# EAGLE design camera (EAGLE 9.6.2)
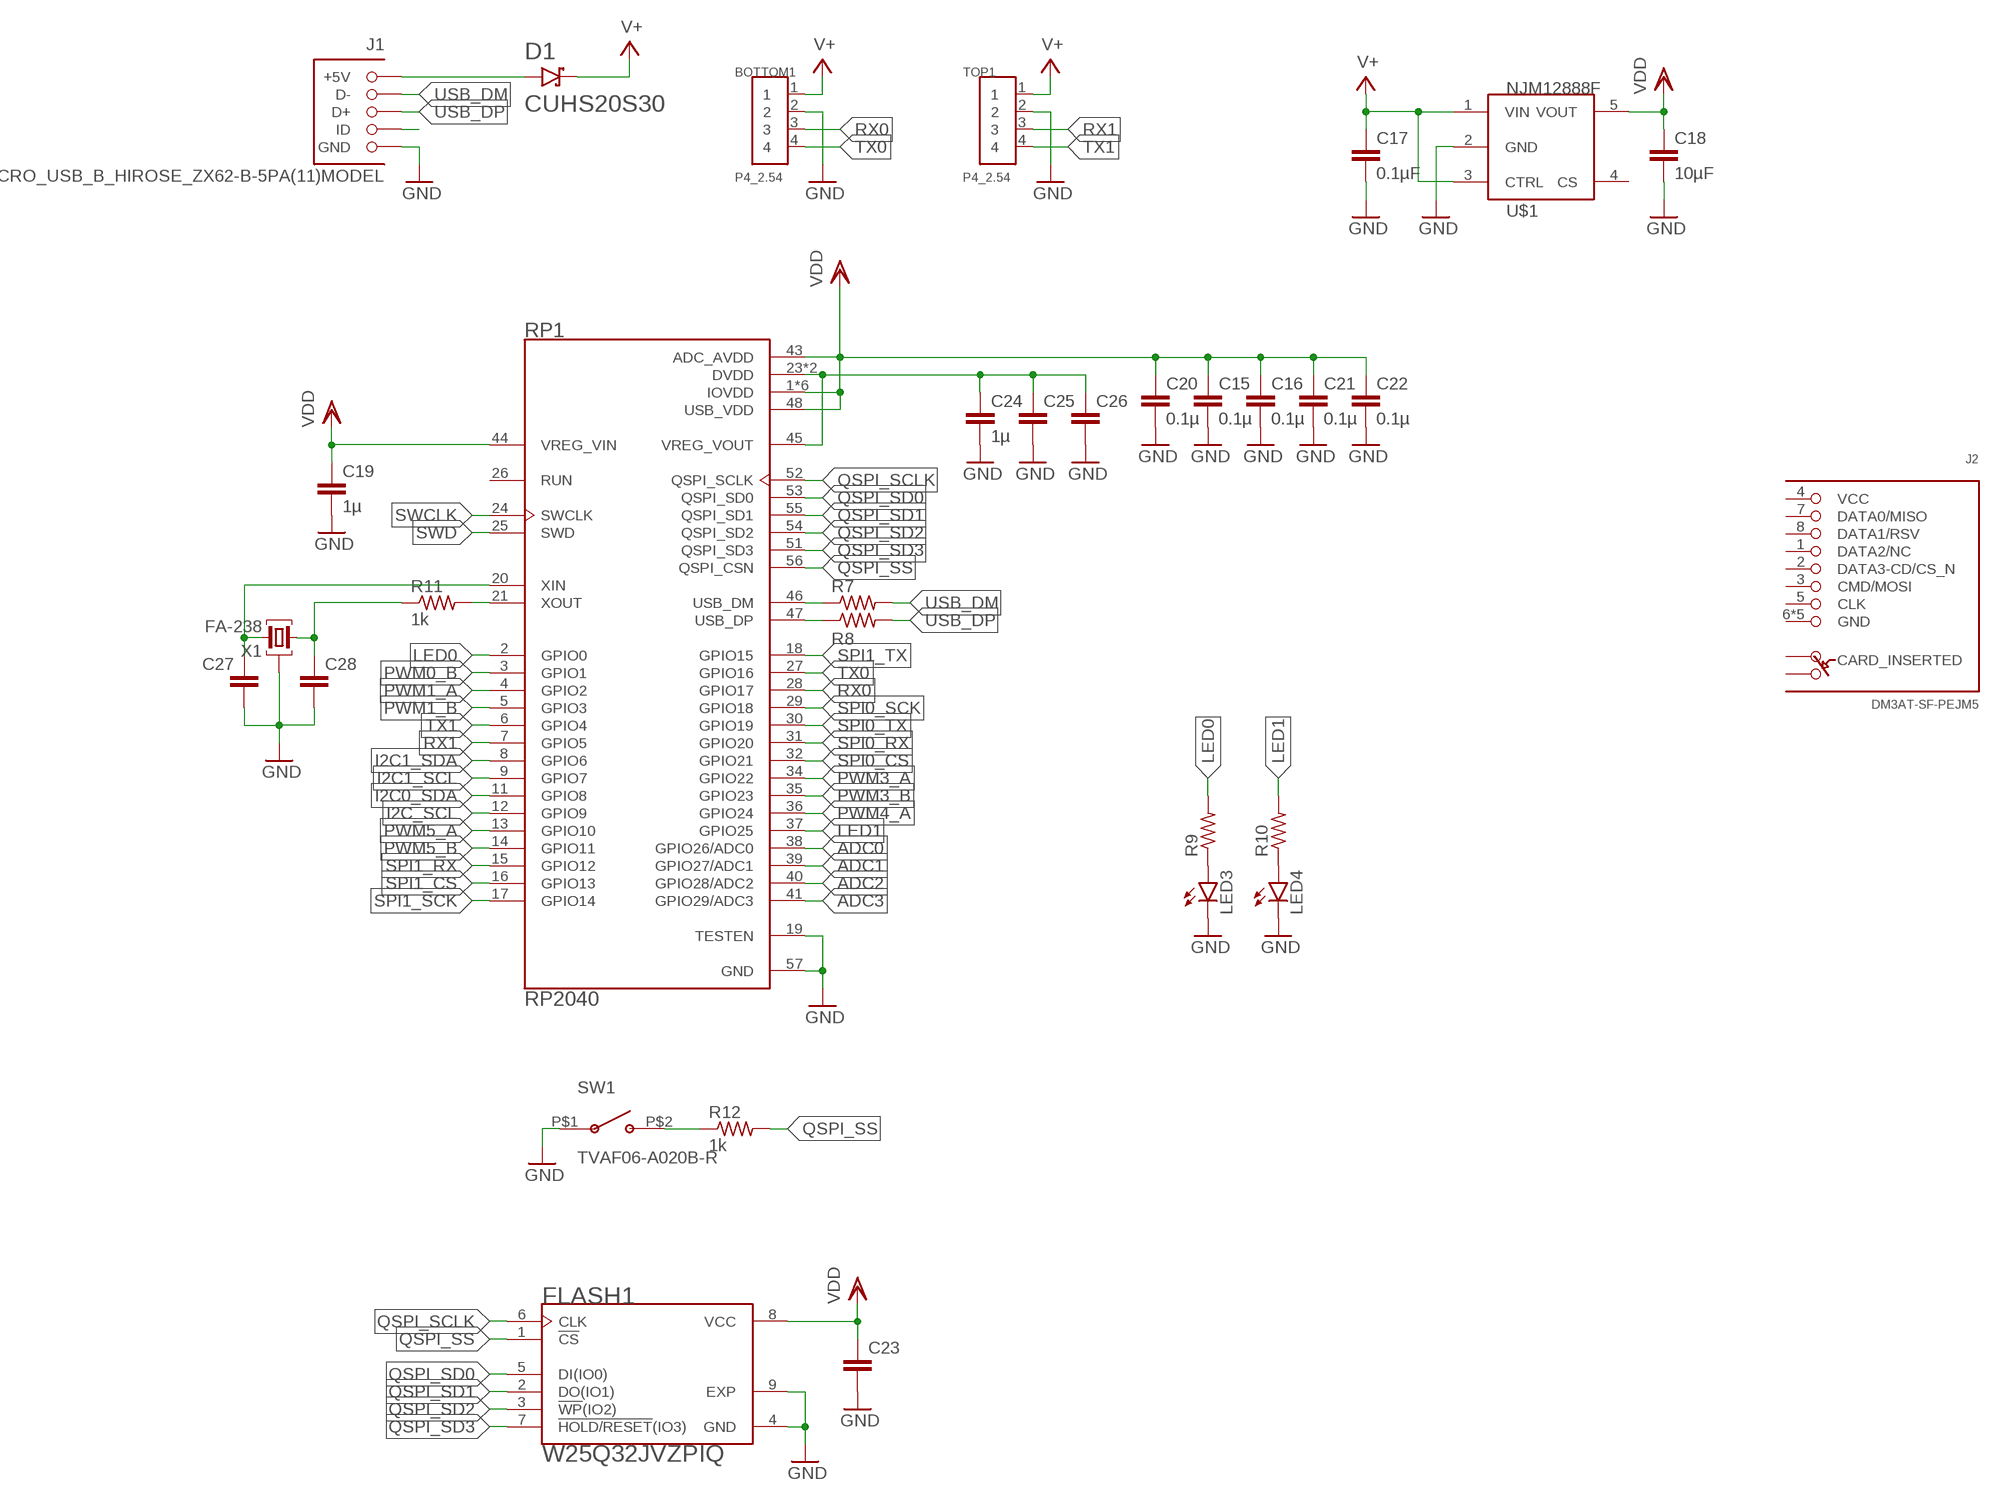
[diagram p0: schematic, sheet 1]

## Parts
BOTTOM1  P4_2.54  [P4_2.54]
C15  0.1µ  C-EUC0402  [C0402]
C16  0.1µ  C-EUC0402  [C0402]
C17  0.1µF  C-EUC0402  [C0402]
C18  10µF  C-EUC0402  [C0402]
C19  1µ  C-EUC0402  [C0402]
C20  0.1µ  C-EUC0402  [C0402]
C21  0.1µ  C-EUC0402  [C0402]
C22  0.1µ  C-EUC0402  [C0402]
C23  C-EUC0402  [C0402]
C24  1µ  C-EUC0402  [C0402]
C25  C-EUC0402  [C0402]
C26  C-EUC0402  [C0402]
C27  C-EUC0402  [C0402]
C28  C-EUC0402  [C0402]
D1  CUHS20S30  [CUHS20S30]
FLASH1  W25Q32JVZPIQ  [SON127P600X500X80-9N]
J1  MICRO_USB_B_HIROSE_ZX62-B-5PA(11)MODEL  [GHI-CONNECTORS_10118192-0001LF(MICRO-USB-B-AMPHENOL-FCI)]
J2  DM3AT-SF-PEJM5  [DM3AT-SF-PEJM5]
LED3  LEDCHIPLED_0603  [CHIPLED_0603]
LED4  LEDCHIPLED_0603  [CHIPLED_0603]
R7  R-US_R0402  [R0402]
R8  R-US_R0402  [R0402]
R9  R-US_R0402  [R0402]
R10  R-US_R0402  [R0402]
R11  1k  R-US_R0402  [R0402]
R12  1k  R-US_R0402  [R0402]
RP1  RP2040  [QFN40P700X700X90-57N]
SW1  TVAF06-A020B-R  [TVAF06-A020B-R]
TOP1  P4_2.54  [P4_2.54]
U$1  NJM12888F  [SOT95P240X110-5N]
X1  FA-238  [FA-238]

## Nets
1V2: C24.1 C25.1 C26.1 RP1.23(DVDD) RP1.45(VREG_VOUT) RP1.50(DVDD)
ADC0: RP1.38(GPIO26/ADC0)
ADC1: RP1.39(GPIO27/ADC1)
ADC2: RP1.40(GPIO28/ADC2)
ADC3: RP1.41(GPIO29/ADC3)
GND: BOTTOM1.2 C15.2 C16.2 C17.2 C18.2 C19.2 C20.2 C21.2 C22.2 C23.2 C24.2 C25.2 C26.2 C27.2 C28.2 FLASH1.4(GND) FLASH1.9(EXP) J1.CGND1(GND) J1.CGND2(GND) J1.CGND3(GND) J1.CGND4(GND) J1.CGND5(GND) J1.CGND6(GND) J1.GND LED3.C LED4.C RP1.19(TESTEN) RP1.57(GND) SW1.P$1(A) TOP1.2 U$1.2(GND) X1.2(G) X1.4(G)
I2C0_SDA: RP1.11(GPIO8)
I2C1_SCL: RP1.9(GPIO7)
I2C1_SDA: RP1.8(GPIO6)
I2C_SCL: RP1.12(GPIO9)
LED0: R9.2 RP1.2(GPIO0)
LED1: R10.2 RP1.37(GPIO25)
N$6: J1.ID
N$8: D1.A J1.VBUS(+5V)
N$9: LED3.A R9.1
N$10: LED4.A R10.1
N$11: C28.1 R11.1 X1.1
N$12: R12.1 SW1.P$2(B)
PWM0_B: RP1.3(GPIO1)
PWM1_A: RP1.4(GPIO2)
PWM1_B: RP1.5(GPIO3)
PWM3_A: RP1.34(GPIO22)
PWM3_B: RP1.35(GPIO23)
PWM4_A: RP1.36(GPIO24)
PWM5_A: RP1.13(GPIO10)
PWM5_B: RP1.14(GPIO11)
QSPI_SCLK: FLASH1.6(CLK) RP1.52(QSPI_SCLK)
QSPI_SD0: FLASH1.5(DI(IO0)) RP1.53(QSPI_SD0)
QSPI_SD1: FLASH1.2(DO(IO1)) RP1.55(QSPI_SD1)
QSPI_SD2: FLASH1.3(!WP!(IO2)) RP1.54(QSPI_SD2)
QSPI_SD3: FLASH1.7(!HOLD/RESET!(IO3)) RP1.51(QSPI_SD3)
QSPI_SS: FLASH1.1(!CS) R12.2 RP1.56(QSPI_CSN)
RX0: BOTTOM1.3 RP1.28(GPIO17)
RX1: RP1.7(GPIO5) TOP1.3
SPI0_CS: RP1.32(GPIO21)
SPI0_RX: RP1.31(GPIO20)
SPI0_SCK: RP1.29(GPIO18)
SPI0_TX: RP1.30(GPIO19)
SPI1_CS: RP1.16(GPIO13)
SPI1_RX: RP1.15(GPIO12)
SPI1_SCK: RP1.17(GPIO14)
SPI1_TX: RP1.18(GPIO15)
SWCLK: RP1.24(SWCLK)
SWD: RP1.25(SWD)
TX0: BOTTOM1.4 RP1.27(GPIO16)
TX1: RP1.6(GPIO4) TOP1.4
USB_DM: J1.D- R7.2
USB_DM_1: R7.1 RP1.46(USB_DM)
USB_DP: J1.D+ R8.2
USB_DP_1: R8.1 RP1.47(USB_DP)
V+: BOTTOM1.1 C17.1 D1.C TOP1.1 U$1.1(VIN) U$1.3(CTRL)
VDD: C15.1 C16.1 C18.1 C19.1 C20.1 C21.1 C22.1 C23.1 FLASH1.8(VCC) RP1.1(IOVDD) RP1.10(IOVDD) RP1.22(IOVDD) RP1.33(IOVDD) RP1.42(IOVDD) RP1.43(ADC_AVDD) RP1.44(VREG_VIN) RP1.48(USB_VDD) RP1.49(IOVDD) U$1.5(VOUT)
XIN1: C27.1 RP1.20(XIN) X1.3
XOUT1: R11.2 RP1.21(XOUT)
Unconnected: J2.1(DATA2/NC) J2.2(DATA3-CD/CS_N) J2.3(CMD/MOSI) J2.4(VCC) J2.5(CLK) J2.6(GND) J2.7(DATA0/MISO) J2.8(DATA1/RSV) J2.A J2.B J2.MOUNT0(GND) J2.MOUNT1(GND) J2.MOUNT2(GND) J2.MOUNT3(GND) RP1.26(RUN) U$1.4(CS)

## Library data of the parts
BOTTOM1 TOP1 = pins:P4_2.54
C15-C28 = rcl:C-EU: CAPACITOR, European symbol; SPICEPREFIX: C
D1 = diodes:CUHS20S30
FLASH1 = W25Q32JVZPIQ:W25Q32JVZPIQ: Serial Flash Memory With Dual, Quad Spi Check availability <https://pricing.snapeda.com/parts/W25Q32JVZPIQ/Winbond/view-part?ref=eda>; AVAILABILITY: In Stock; DESCRIPTION: FLASH - NOR Memory IC 32Mb (4M x 8) SPI - Quad I/O 133 MHz 8-WSON (6x5); MF: Winbond; MP: W25Q32JVZPIQ; PACKAGE: WSON-8 Winbond; PRICE: None; PURCHASE-URL: https://pricing.snapeda.com/search/part/W25Q32JVZPIQ/?ref=eda
J1 = connector:MICRO_USB_B_HIROSE_ZX62-B-5PA(11): Connector Receptacle USB - micro B 2.0 5 Position Surface Mount, Right Angle, Horizontal Bottom Mount
J2 = connector:DM3AT-SF-PEJM5: CONN MICRO SD R/A PUSH-PUSH SMD; DESCRIPTION: CONN MICRO SD CARD PUSH-PUSH R/A; DIGIKEY: HR1964CT-ND; MANUFACTURER: Hirose Electric Co Ltd; MPN: DM3AT-SF-PEJM5
LED3 LED4 = led:LED: LED OSRAM: - CHIPLED LG R971, LG N971, LY N971, LG Q971, LY Q971, LO R971, LY R971 LH N974, LH R974 LS Q976, LO Q976, LY Q976 LO Q996 - Hyper CHIPLED LW Q18S LB Q993, LB Q99A, LB R99A - SideLED LS A670, LO A670, LY A670, LG A670, LP A670 LB A673, LV A673, LT A673, LW A673 LH A674 LY A675 LS A676, LA A676, LO A676, LY A676, LW A676 LS A679, LY A679, LG A679 - Hyper Micro SIDELED® LS Y876, LA Y876, LO Y876, LY Y876 LT Y87S - SmartLED LW L88C, LW L88S LB L89C, LB L89S, LG L890 LS L89K, LO L89K, LY L89K LS L896, LA L896, LO L896, LY L896 - TOPLED LS T670, LO T670, LY T670, LG T670, LP T670 LSG T670, LSP T670, LSY T670, LOP T670, LYG T670 LG T671, LOG T671, LSG T671 LB T673, LV T673, LT T673, LW T673 LH T674 LS T676, LA T676, LO T676, LY T676, LB T676, LH T676, LSB T676, LW T676 LB T67C, LV T67C, LT T67C, LS T67K, LO T67K, LY T67K, LW E67C LS E67B, LA E67B, LO E67B, LY E67B, LB E67C, LV E67C, LT E67C LW T67C LS T679, LY T679, LG T679 LS T770, LO T770, LY T770, LG T770, LP T770 LB T773, LV T773, LT T773, LW T773 LH T774 LS E675, LA E675, LY E675, LS T675 LS T776, LA T776, LO T776, LY T776, LB T776 LHGB T686 LT T68C, LB T68C - Hyper Mini TOPLED® LB M676 - Mini TOPLED Santana® LG M470 LS M47K, LO M47K, LY M47K Source: http://www.osram.convergy.de LUXEON: - LUMILED® LXK2-PW12-R00, LXK2-PW12-S00, LXK2-PW14-U00, LXK2-PW14-V00 LXK2-PM12-R00, LXK2-PM12-S00, LXK2-PM14-U00 LXK2-PE12-Q00, LXK2-PE12-R00, LXK2-PE12-S00, LXK2-PE14-T00, LXK2-PE14-U00 LXK2-PB12-K00, LXK2-PB12-L00, LXK2-PB12-M00, LXK2-PB14-N00, LXK2-PB14-P00, LXK2-PB14-Q00 LXK2-PR12-L00, LXK2-PR12-M00, LXK2-PR14-Q00, LXK2-PR14-R00 LXK2-PD12-Q00, LXK2-PD12-R00, LXK2-PD12-S00 LXK2-PH12-R00, LXK2-PH12-S00 LXK2-PL12-P00, LXK2-PL12-Q00, LXK2-PL12-R00 Source: www.luxeon.com KINGBRIGHT: KA-3528ASYC Source: www.kingbright.com
R7-R12 = rcl:R-US_: RESISTOR, American symbol; SPICEPREFIX: R
RP1 = RP2040:RP2040: Check availability <https://pricing.snapeda.com/parts/RP2040/Raspberry%20Pi/view-part?ref=eda>; AVAILABILITY: In Stock; DESCRIPTION: RP2040 chip for Raspberry Pi Pico - ARM® Cortex®-M0+ MCU 32-Bit; MF: Raspberry Pi; MP: RP2040; PACKAGE: None; PRICE: None; PURCHASE-URL: https://pricing.snapeda.com/search/part/RP2040/?ref=eda
SW1 = switches:TVAF06-A020B-R
U$1 = regulators:NJM12888F
X1 = crystal':FA-238: CRYSTAL

## Board
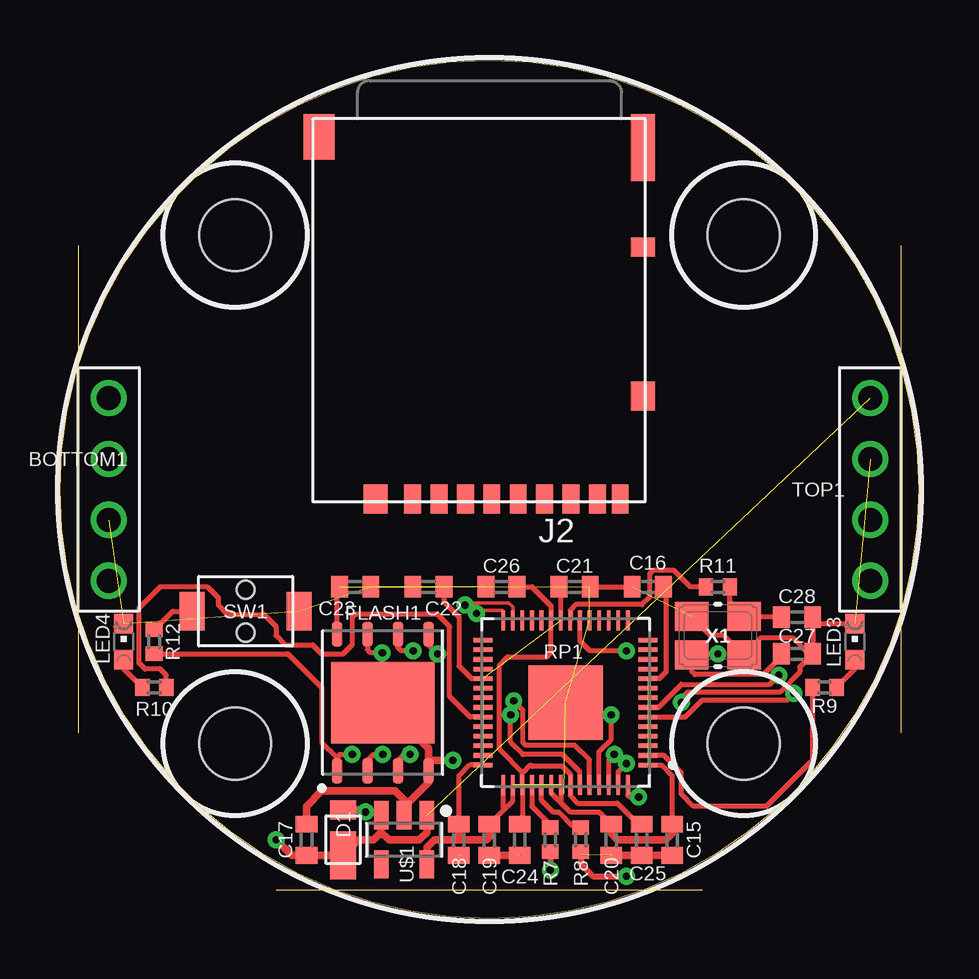
[diagram p1: board, top side]
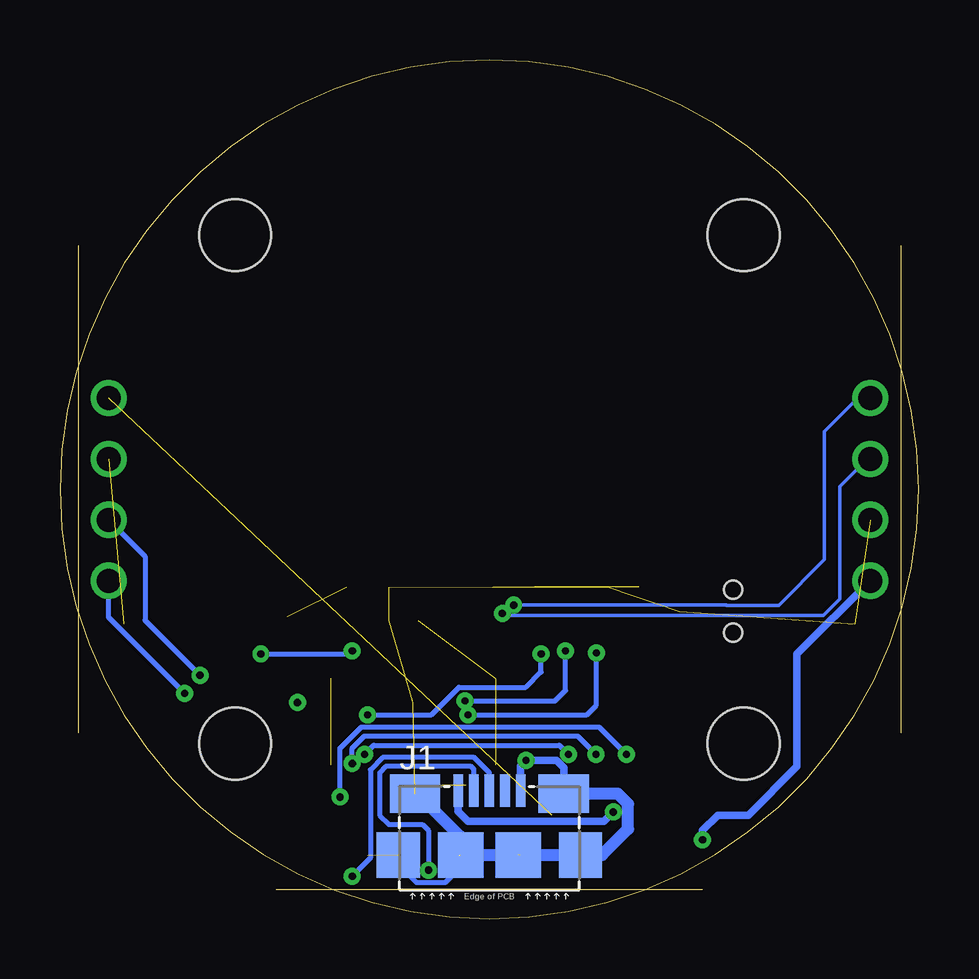
[diagram p2: board, bottom side, seen from below]

Size 35.8 x 35.8 mm. Coordinates in mm from the lower left corner, seen from the top.
Outline: 9.01,1.2 26.79,1.2
Outline: 35.05,28.06 35.05,7.74
Outline: 0.75,28.06 0.75,7.74
Outline: 17.9,0 arc-90 0,17.9 arc-90 17.9,35.8 arc-90 35.8,17.9 arc-90 17.9,0
Copper layers (1*16): Top 0.035mm / dielectric 1.5mm / Bottom 0.035mm
Design rules "default": minimum track width 6mil, minimum drill 0.35mm, track to track 6mil, track to pad 6mil, pad to pad 6mil, via to via 6mil, smd to smd 6mil, copper to edge 40mil, drill to drill 6mil, minimum pad ring 10mil, minimum via ring 8mil, stop-mask expansion 4mil, vias tented up to drill 0mil, thermal gap 10mil
Holes 3 mm at 28.5,28.5 28.5,7.3 7.3,28.5 7.3,7.3

### Footprints (pad centres in the part's own frame; a part is rotated, then mirrored left to right if it is on the bottom)
P4_2.54 = drill 1: 1 0,3.81; 2 0,1.27; 3 0,-1.27; 4 0,-3.81
C0402 = smd 0.7 x 0.9: 1 -0.65,0; 2 0.65,0
CUHS20S30 = smd 0.8 x 1.1: A 1.25,0 | smd 2 x 1.1: C -0.65,0
SON127P600X500X80-9N = smd 1.04 x 0.44: 1 -2.845,1.905; 2 -2.845,0.635; 3 -2.845,-0.635; 4 -2.845,-1.905; 5 2.845,-1.905; 6 2.845,-0.635; 7 2.845,0.635; 8 2.845,1.905 | smd 3.4 x 4.3: 9 0,0
GHI-CONNECTORS_10118192-0001LF(MICRO-USB-B-AMPHENOL-FCI) = smd 1.8 x 1.9: CGND1 -3.8,0; CGND4 3.8,0 | smd 1.9 x 1.9: CGND2 -1.2,0; CGND3 1.2,0 | smd 2.1 x 1.6: CGND5 3.1,2.55; CGND6 -3.1,2.55 | smd 0.4 x 1.35: D+ 0,2.675; D- -0.65,2.675; GND 1.3,2.675; ID 0.65,2.675; VBUS -1.3,2.675
DM3AT-SF-PEJM5 = smd 0.7 x 1.2: 1 3.2,-0.1; 2 2.1,-0.1; 3 1,-0.1; 4 -0.1,-0.1; 5 -1.2,-0.1; 6 -2.3,-0.1; 7 -3.4,-0.1; 8 -4.5,-0.1; B -5.45,-0.1 | smd 1 x 0.8: A -6.4,-10.6 | smd 1 x 1.2: MOUNT0 4.75,-0.1; MOUNT1 -6.4,-4.4 | smd 1 x 2.8: MOUNT2 -6.4,-14.75 | smd 1.3 x 1.9: MOUNT3 7.1,-15.2
CHIPLED_0603 = smd 0.8 x 0.8: A 0,-0.75; C 0,0.75
R0402 = smd 0.6 x 0.7: 1 -0.5,0; 2 0.5,0
QFN40P700X700X90-57N = smd 0.84 x 0.2: 1 -3.435,2.6; 2 -3.435,2.2; 3 -3.435,1.8; 4 -3.435,1.4; 5 -3.435,1; 6 -3.435,0.6; 7 -3.435,0.2; 8 -3.435,-0.2; 9 -3.435,-0.6; 10 -3.435,-1; 11 -3.435,-1.4; 12 -3.435,-1.8; 13 -3.435,-2.2; 14 -3.435,-2.6; 29 3.435,-2.6; 30 3.435,-2.2; 31 3.435,-1.8; 32 3.435,-1.4; 33 3.435,-1; 34 3.435,-0.6; 35 3.435,-0.2; 36 3.435,0.2; 37 3.435,0.6; 38 3.435,1; 39 3.435,1.4; 40 3.435,1.8; 41 3.435,2.2; 42 3.435,2.6 | smd 0.2 x 0.84: 15 -2.6,-3.435; 16 -2.2,-3.435; 17 -1.8,-3.435; 18 -1.4,-3.435; 19 -1,-3.435; 20 -0.6,-3.435; 21 -0.2,-3.435; 22 0.2,-3.435; 23 0.6,-3.435; 24 1,-3.435; 25 1.4,-3.435; 26 1.8,-3.435; 27 2.2,-3.435; 28 2.6,-3.435; 43 2.6,3.435; 44 2.2,3.435; 45 1.8,3.435; 46 1.4,3.435; 47 1,3.435; 48 0.6,3.435; 49 0.2,3.435; 50 -0.2,3.435; 51 -0.6,3.435; 52 -1,3.435; 53 -1.4,3.435; 54 -1.8,3.435; 55 -2.2,3.435; 56 -2.6,3.435 | smd 3.1 x 3.1: 57 0,0
TVAF06-A020B-R = smd 1.6 x 1.05: P$1 0,2.225; P$2 0,-2.225 | hole 0.75: -0.9,0; 0.9,0
SOT95P240X110-5N = smd 1.18 x 0.609: 1 -1.024,0.95; 2 -1.024,0; 3 -1.024,-0.95; 4 1.024,-0.95; 5 1.024,0.95
FA-238 = smd 1.4 x 1.2: 1 -1.1,-0.8; 2 1.1,-0.8; 3 1.1,0.8; 4 -1.1,0.8

### Placement (x,y rotation side)
BOTTOM1  2.02,17.9 180 top
C15  25.52,3.29 270 top
C16  24.5,13.84 180 top
C17  10.28,3.29 90 top
C18  16.63,3.29 270 top
C19  17.9,3.29 270 top
C20  22.98,3.29 270 top
C21  21.46,13.84 0 top
C22  15.36,13.84 180 top
C23  12.31,13.84 0 top
C24  19.17,3.29 270 top
C25  24.25,3.29 270 top
C26  18.41,13.84 180 top
C27  30.73,11.04 0 top
C28  30.73,12.57 0 top
D1  11.8,3.29 90 top
FLASH1  13.45,9.01 90 top
J1  17.9,2.66 0 bottom
J2  17.9,17.39 180 top
LED3  33.14,11.55 0 top
LED4  2.66,11.55 0 top
R7  20.44,3.29 270 top
R8  21.71,3.29 270 top
R9  31.87,9.64 180 top
R10  3.93,9.64 0 top
R11  27.42,13.84 180 top
R12  3.93,11.55 270 top
RP1  21.07,9.01 180 top
SW1  7.74,12.82 270 top
TOP1  33.77,17.9 0 top
U$1  14.34,3.29 270 top
X1  27.42,11.8 180 top

### Tracks (layer width: path | path; a pad name or v marks a point on that pad's centre or on a via)
1V2
  Top 0.2: C24.1 19.27,4.05 RP1.45 19.27,6.07 19.3,6.09 | C25.1 24.11,3.94 23.23,4.82 21.58,4.82 21.27,5.13 RP1.50 21.27,6.02 20.95,6.34 19.68,6.34 19.61,6.41 19.3,6.09 | 19.3,6.09 18.31,7.07 18.31,10.56 18.67,10.92 20.32,10.92 20.47,11.08 RP1.23 20.47,13.04 19.68,13.84 C26.1
GND  (via drill 0.3)  (14 unrouted)
  Top 0.2: 22.07,13.8 C21.2 C16.2 | C27.2 C28.2 31.64,12.3 LED3.C | X1.2 27.1,11.83 27.63,11.83 28.45,11 X1.4 29.24,11.72 30.52,11.72 31.2,11.04 C27.2 | C27.2 30.84,10.51 30.84,10.28 30.01,9.44 26.16,9.44 25.9,9.18 v25.9,9.01
  Top 0.305: C19.2 C24.2 | C20.2 C25.2 C15.2 | 15.36,6.55 15.41,6.6 v16.38,6.6 | 15.36,6.55 FLASH1.4 15.36,5.67 14.36,4.68 14.34,4.7 U$1.2 14.34,4.95 13.96,5.33 10.91,5.33 10.28,4.69 C17.2 | FLASH1.9 15.36,7.1 15.36,6.55
  Bottom 0.2: J1.CGND1 21.7,2.28 20.94,1.52 19.73,1.52 19.1,2.15 J1.CGND2
  Bottom 0.305: J1.GND 16.6,6.37 v16.38,6.6 15.11,6.6 14.8,6.29 J1.CGND5
  Bottom 0.508: J1.CGND6 20.89,5.21 19.1,3.42 J1.CGND2 J1.CGND3 J1.CGND4 13.2,2.66 12.12,3.74 12.12,4.78 12.55,5.21 J1.CGND5
LED0
  Top 0.2: R9.2 31.37,6.6 29.46,4.69 26.41,4.69 25.9,5.2 25.9,6.09 25.18,6.81 RP1.2
LED1
  Top 0.2: RP1.37 17.1,8.41 16.25,9.26 16.25,12.18 15.74,12.69 12.31,12.69 12.18,12.57 12.18,11.42 11.8,11.04 10.91,11.04 10.53,11.42 9.39,11.42 9.01,11.8 9.01,12.18 8.5,12.69 6.98,12.69 6.6,13.07 6.6,13.38 6.13,13.85 4.19,13.85 3.29,12.95 3.29,10.66 3.55,10.41 4.18,10.41 4.43,10.16 R10.2
N$8  (via drill 0.3)
  Top 0.305: D1.A 12.64,4.54 v12.73,4.45
  Bottom 0.305: J1.VBUS 19.2,4.47 18.79,4.06 13.13,4.06 v12.73,4.45
N$9
  Top 0.2: R9.1 33.14,10.41 LED3.A
N$10
  Top 0.2: R10.1 2.66,10.41 LED4.A
N$11
  Top 0.2: C28.1 30.04,12.6 X1.1 27.92,13.2 R11.1
N$12
  Top 0.2: R12.1 4.7,12.82 SW1.P$2
QSPI_SCLK  (via drill 0.3)
  Top 0.2: RP1.52 22.07,6.61 21.46,7.23 19.42,7.23 19.3,7.36 19.3,8.69 v18.92,9.08 | v14.72,11.17 14.24,11.17 14.09,11.32 FLASH1.6
  Bottom 0.2: v18.92,9.08 15.17,9.08 14.72,9.52 v14.72,11.17
QSPI_SD0  (via drill 0.3)
  Top 0.2: RP1.53 22.47,6.98 22.98,7.49 v22.98,8.5 | v15.74,11.04 15.36,11.42 FLASH1.5
  Bottom 0.2: v22.98,8.5 20.31,8.5 19.17,9.64 16.38,9.64 15.74,10.28 v15.74,11.04
QSPI_SD1  (via drill 0.3)
  Top 0.2: RP1.55 23.27,6.13 v23.61,6.47 | FLASH1.2 12.82,6.6 13.07,6.85 v13.45,6.85
  Bottom 0.2: v23.61,6.47 23.61,7.1 23.11,7.61 14.22,7.61 v13.45,6.85
QSPI_SD2  (via drill 0.3)
  Top 0.2: RP1.54 22.88,6.62 v23.11,6.85 | FLASH1.3 14.09,6.6 14.34,6.85 v14.6,6.85
  Bottom 0.2: v23.11,6.85 22.73,7.23 14.98,7.23 v14.6,6.85
QSPI_SD3  (via drill 0.3)
  Top 0.2: RP1.51 21.67,6.12 20.95,6.85 19.3,6.85 18.79,7.36 v18.79,8.5 | v13.43,11.09 12.96,11.09 12.82,11.22 FLASH1.7
  Bottom 0.2: v18.79,8.5 13.84,8.5 13.43,8.9 v13.43,11.09
QSPI_SS  (via drill 0.3)
  Top 0.2: RP1.56 23.67,5.14 23.74,5.07 v24.12,5.07 | FLASH1.1 11.55,6.72 | v12.18,6.85 11.68,6.85 11.55,6.72 | R12.2 9.51,11.05 10.91,9.64 10.91,7.36 11.55,6.72
  Bottom 0.2: v24.12,5.07 24.12,7.1 23.23,7.99 13.33,7.99 v12.18,6.85
RX0  (via drill 0.3)
  Top 0.152: RP1.28 18.47,12.82 18.44,12.86 17.5,12.86 v17.36,12.72
  Bottom 0.152: v17.36,12.72 17.14,12.72 17.06,12.64 3.98,12.64 3.29,13.33 3.29,18.03 2.15,19.17 BOTTOM1.3
RX1  (via drill 0.3)
  Top 0.2: RP1.7 24.94,8.81 25.9,9.77 29.58,9.77 v29.96,10.15
  Bottom 0.2: v29.96,10.15 32.25,12.44 32.25,15.11 TOP1.3
TX0  (via drill 0.3)
  Top 0.152: RP1.27 18.88,12.99 18.69,13.17 16.98,13.17 v16.88,13.07
  Bottom 0.152: v16.88,13.07 8.01,13.07 5.84,13.07 3.93,14.98 3.93,20.31 2.53,21.71 BOTTOM1.4
TX1  (via drill 0.3)
  Top 0.2: RP1.6 26.06,8.41 26.77,9.12 30.33,9.12 v30.6,9.39
  Bottom 0.2: v30.6,9.39 33.77,12.57 TOP1.4
USB_DM  (via drill 0.3)
  Top 0.254: R7.2 v20.44,2.02
  Bottom 0.2: J1.D- 18.55,6.23 18.66,6.34 22.22,6.34 22.47,6.09 22.47,4.31 22.09,3.93 20.69,3.93 20.44,3.68 v20.44,2.02
USB_DM_1
  Top 0.2: RP1.46 19.67,4.69 20.44,3.92 R7.1
USB_DP  (via drill 0.3)
  Top 0.254: R8.2 21.71,2.28 22.22,1.77 v23.61,1.77
  Bottom 0.2: J1.D+ 17.9,6.09 18.54,6.72 22.34,6.72 22.85,6.22 22.85,2.53 v23.61,1.77
USB_DP_1
  Top 0.2: R8.1 21.64,3.86 21.39,3.86 20.81,4.44 20.57,4.44 20.07,4.93 RP1.47
V+  (via drill 0.3)  (1 unrouted)
  Top 0.305: U$1.1 15.29,3.61 14.98,3.29 13.71,3.29 13.39,3.61 | 13.39,3.61 U$1.3 | 13.39,3.61 13.08,3.29 12.45,3.29 D1.C C17.1 9.66,2.64 v9.01,3.29
  Bottom 0.305: BOTTOM1.1 5.07,11.04 5.07,6.34 7.1,4.31 8.37,4.31 9.01,3.68 v9.01,3.29
VDD  (6 unrouted)
  Top 0.2: RP1.44 18.88,4.92 18.47,4.52 | 18.47,4.52 C19.1 | RP1.42 17.08,6.41 16.63,5.96 C18.1 | RP1.48 20.47,5.24 21.26,4.45 22.47,4.45 C20.1 | RP1.49 20.88,4.84 | RP1.33 17.15,10.01 16.63,10.53 16.63,12.58 16.01,13.2 C22.1 | RP1.43 18.47,4.52 | FLASH1.8 11.55,13.72 C23.1 | RP1.22 20.88,13.77 C21.1 | RP1.1 25.07,6.41 25.52,5.96 C15.1 | C16.1 25.27,13.72 25.27,10.28 25,10.01 RP1.10
  Top 0.305: C19.1 17.9,3.42 17.77,3.29 16.63,3.29 | C18.1 16.63,3.29 | C15.1 25.52,3.55 25.27,3.29 23.25,3.29 22.99,3.56 C20.1 | 16.63,3.29 15.61,3.29 15.29,2.97 U$1.5
XIN1  (via drill 0.3)
  Top 0.2: C27.1 30.08,10.93 29.32,10.18 26.46,10.18 26.32,10.31 X1.3 26.36,11.04 v27.42,11.04 | v23.61,11.17 22.09,11.17 21.67,11.58 RP1.20
  Bottom 0.2: v27.42,11.04 23.74,11.04 v23.61,11.17
XOUT1
  Top 0.2: R11.2 26.27,13.84 25.6,14.51 24.71,14.51 24.58,14.38 24.58,13.4 24.27,13.09 21.5,13.09 21.27,12.87 RP1.21